# EAGLE design powerSwitch (EAGLE 9.6.2)
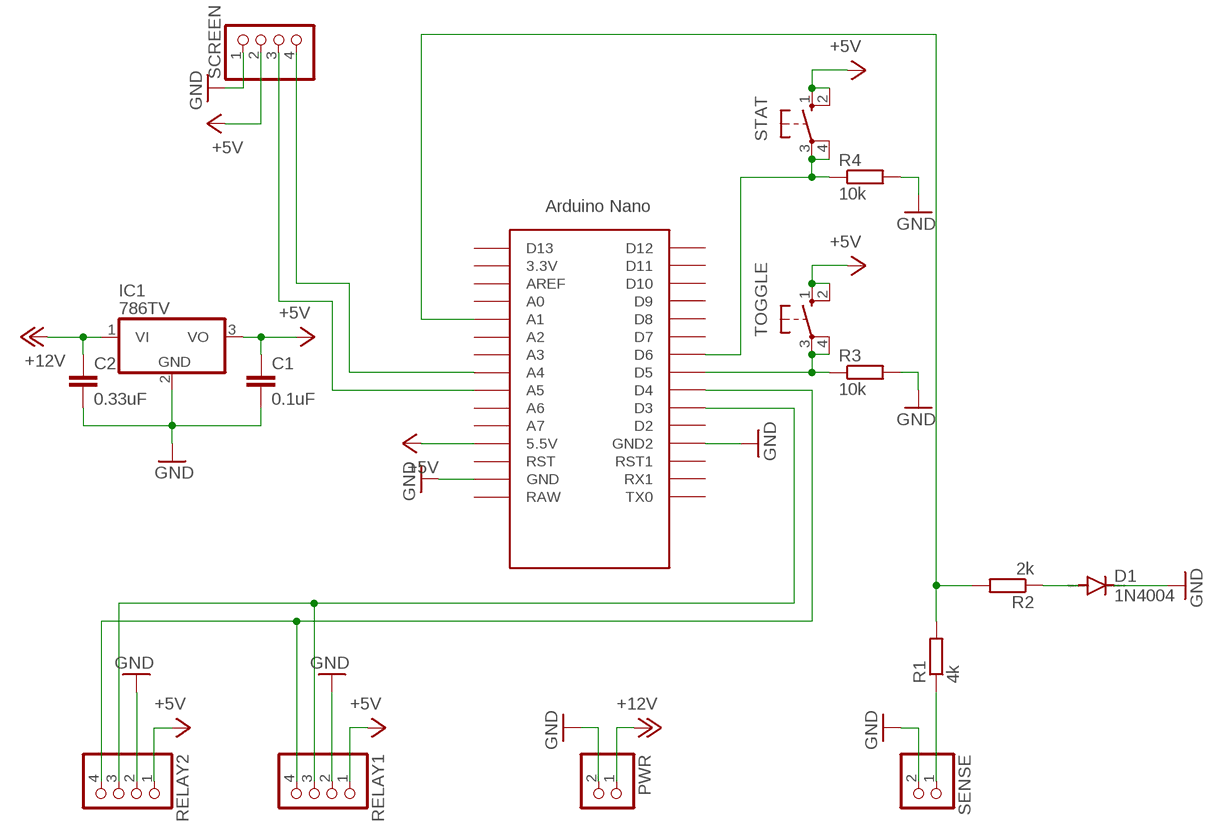
[diagram p0: schematic, sheet 1]

## Parts
C1  0.1uF  C5/2.5  [C5B2.5]
C2  0.33uF  C5/2.5  [C5B2.5]
D1  1N4004  [DO41-10]
IC1  786TV  [TO220V]
NANO  NANO  [NANO]
PWR  PINHD-1X2  [1X02]
R1  4k  R-EU_0204/7  [0204/7]
R2  2k  R-EU_0204/7  [0204/7]
R3  10k  R-EU_0204/7  [0204/7]
R4  10k  R-EU_0204/7  [0204/7]
RELAY1  PINHD-1X4  [1X04]
RELAY2  PINHD-1X4  [1X04]
SCREEN  PINHD-1X4  [1X04]
SENSE  PINHD-1X2  [1X02]
STAT  10-XX  [B3F-10XX]
TOGGLE  10-XX  [B3F-10XX]

## Nets
+5V: C1.1 IC1.3(VO) NANO.5V(5.5V) RELAY1.1 RELAY2.1 SCREEN.2 STAT.1(S) STAT.2(S1) TOGGLE.1(S) TOGGLE.2(S1)
+12V: C2.1 IC1.1(VI) PWR.1
GND: C1.2 C2.2 D1.C IC1.2(GND) NANO.GND NANO.GND1(GND2) PWR.2 R3.2 R4.2 RELAY1.2 RELAY2.2 SCREEN.1 SENSE.2
N$1: NANO.D3 RELAY1.3 RELAY2.3
N$2: NANO.D4 RELAY1.4 RELAY2.4
N$3: R1.1 SENSE.1
N$4: NANO.A1 R1.2 R2.2
N$5: D1.A R2.1
N$6: NANO.D5 R3.1 TOGGLE.3(P) TOGGLE.4(P1)
N$7: NANO.D6 R4.1 STAT.3(P) STAT.4(P1)
N$8: NANO.A5 SCREEN.3
N$9: NANO.A4 SCREEN.4
Unconnected: NANO.3.3V NANO.A0 NANO.A2 NANO.A3 NANO.A6 NANO.A7 NANO.AREF NANO.D2 NANO.D7 NANO.D8 NANO.D9 NANO.D10 NANO.D11 NANO.D12 NANO.D13 NANO.ICSP1 NANO.ICSP2 NANO.ICSP3 NANO.ICSP4 NANO.ICSP5 NANO.ICSP6 NANO.RAW NANO.RST NANO.RST1 NANO.RX1 NANO.TX0

## Library data of the parts
C1 C2 = capacitor-wima:C: CAPACITOR naming: grid - package width
D1 = diode:1N4004: DIODE general purpose rectifier, 1 A
IC1 = linear:78*: Positive VOLTAGE REGULATOR Source: http://cache.national.com/ds/LM/LM78L05.pdf http://www.fairchildsemi.com/ds/LM/LM7805.pdf
NANO = Arduino-clone:NANO: Arduino Nano
PWR SENSE = pinhead:PINHD-1X2: PIN HEADER
R1-R4 = rcl:R-EU_: RESISTOR, European symbol; SPICEPREFIX: R
RELAY1 RELAY2 SCREEN = pinhead:PINHD-1X4: PIN HEADER
STAT TOGGLE = switch-omron:10-XX: OMRON SWITCH; MPN: B3F-1000; OC_FARNELL: 176432; OC_NEWARK: 36M3542

## Board
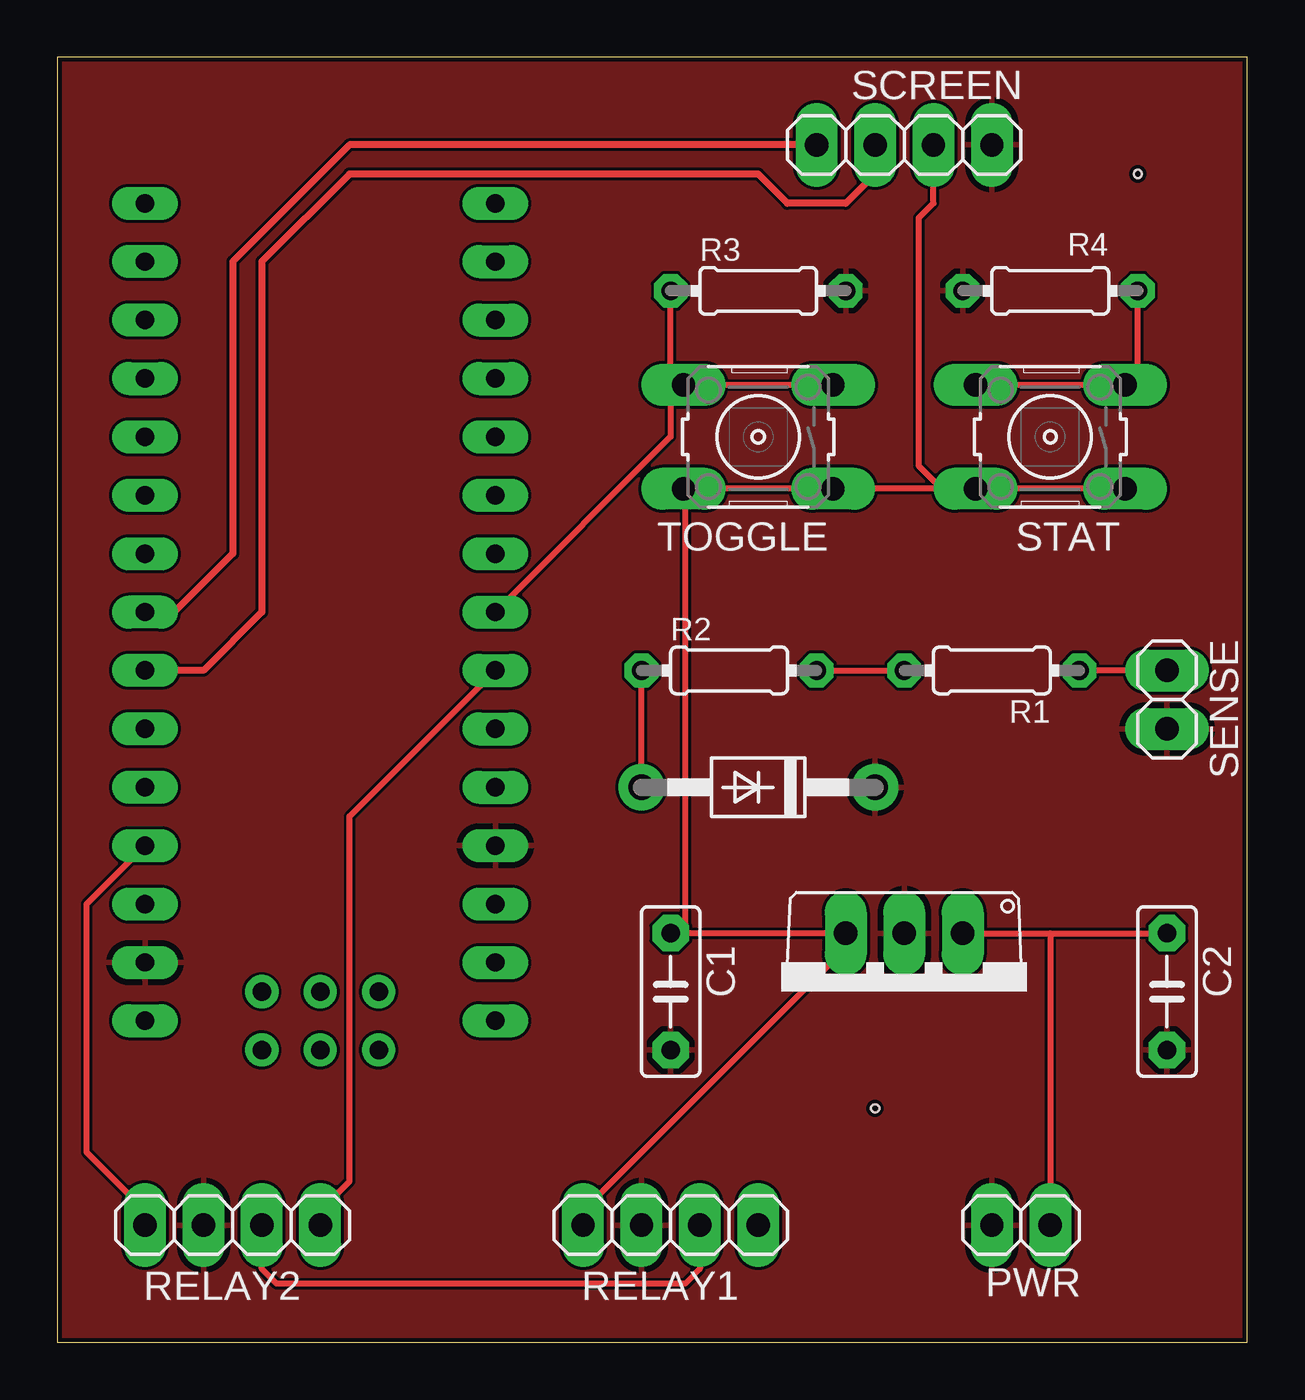
[diagram p1: board, top side]
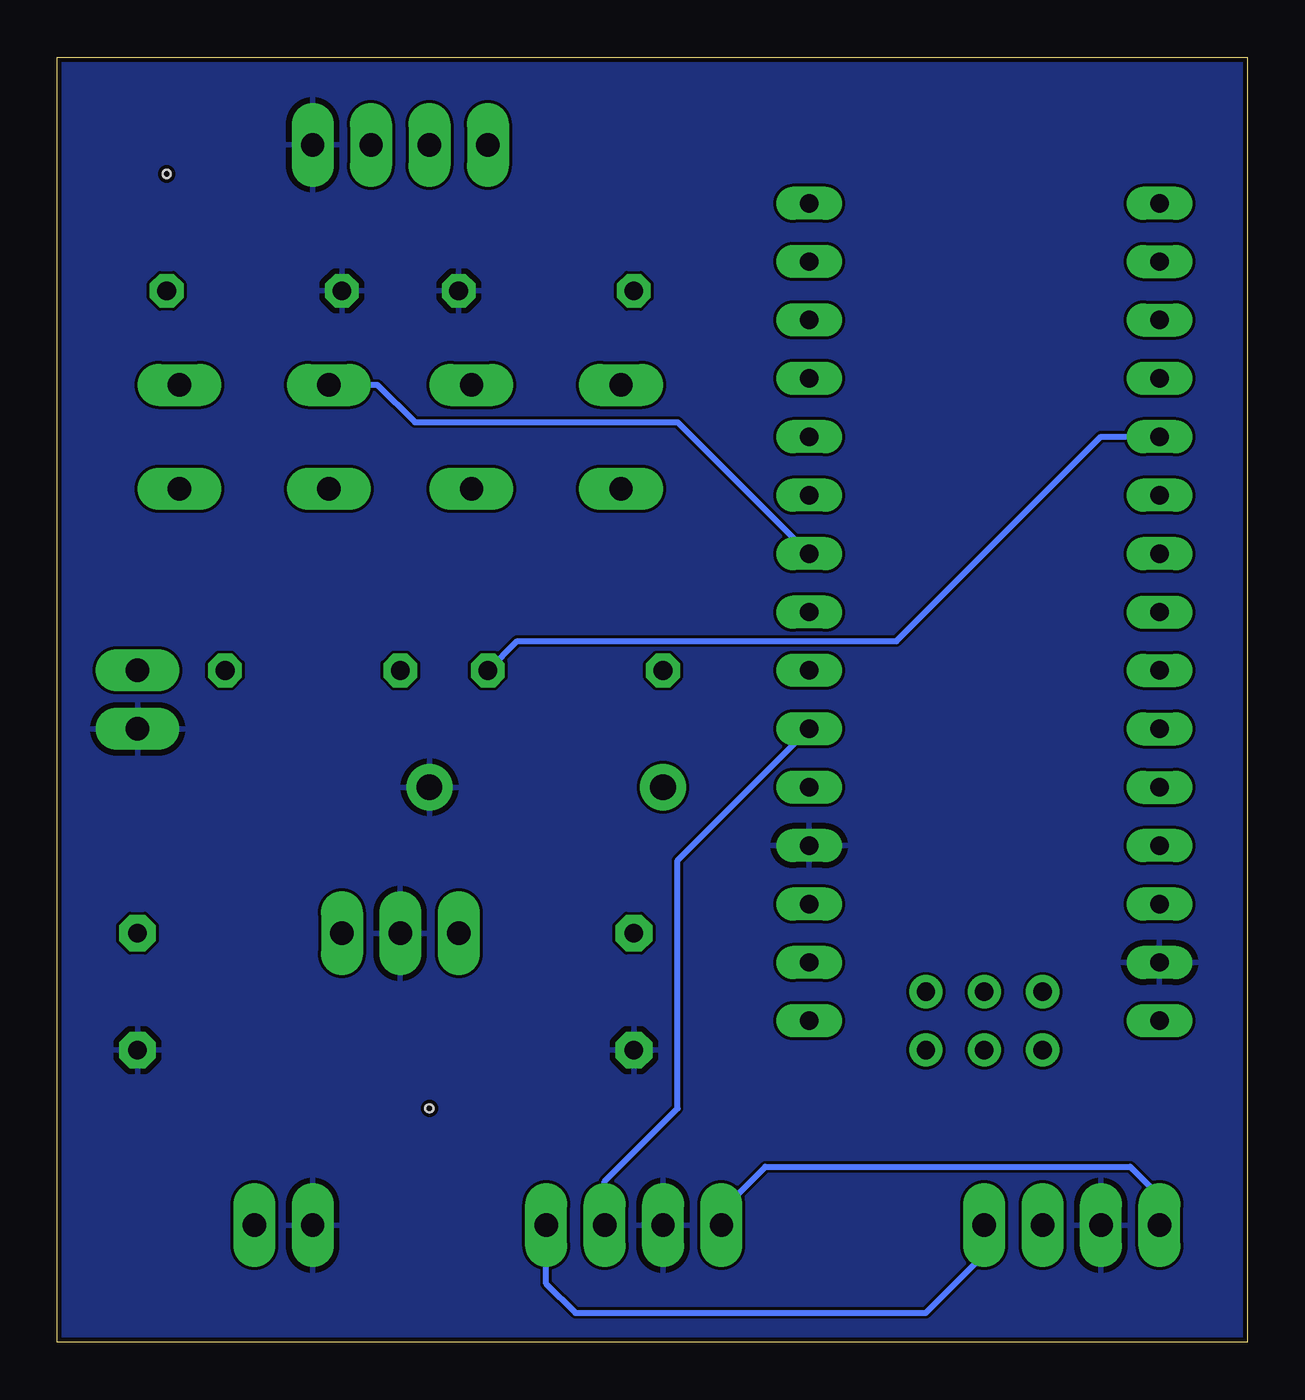
[diagram p2: board, bottom side, seen from below]

Size 51.74 x 55.87 mm. Coordinates in mm from the lower left corner, seen from the top.
Outline: 0,0 51.74,0 51.74,55.87 0,55.87 0,0
Copper layers (1*16): Top 0.035mm / dielectric 1.6mm / Bottom 0.035mm
Design rules "jlcpcb-2layers *": minimum track width 10mil, minimum drill 0.3mm, track to track 5mil, track to pad 5mil, pad to pad 5mil, via to via 5mil, smd to smd 5mil, copper to edge 0.2mm, drill to drill 6mil, minimum pad ring 10mil, minimum via ring 3mil, stop-mask expansion 4mil, vias tented up to drill 0mil, thermal gap 10mil
Holes 0.35 mm at 35.56,10.16 46.99,50.8

### Footprints (pad centres in the part's own frame; a part is rotated, then mirrored left to right if it is on the bottom)
C5B2.5 = drill 0.813 pad 1.6 octagon: 1 -2.54,0; 2 2.54,0
DO41-10 = drill 1.118: A 5.08,0; C -5.08,0
TO220V = drill 1.016 long: 1 -2.54,-2.54; 2 0,-2.54; 3 2.54,-2.54
NANO = drill 0.8 long: 3.3V -10.16,24.13; 5V -10.16,-1.27; A0 -10.16,19.05; A1 -10.16,16.51; A2 -10.16,13.97; A3 -10.16,11.43; A4 -10.16,8.89; A5 -10.16,6.35; A6 -10.16,3.81; A7 -10.16,1.27; AREF -10.16,21.59; D2 5.08,1.27; D3 5.08,3.81; D4 5.08,6.35; D5 5.08,8.89; D6 5.08,11.43; D7 5.08,13.97; D8 5.08,16.51; D9 5.08,19.05; D10 5.08,21.59; D11 5.08,24.13; D12 5.08,26.67; D13 -10.16,26.67; GND -10.16,-6.35; GND1 5.08,-1.27; RAW -10.16,-8.89; RST -10.16,-3.81; RST1 5.08,-3.81; RX1 5.08,-6.35; TX0 5.08,-8.89 | drill 0.8: ICSP1 -5.08,-10.16; ICSP2 -5.08,-7.62; ICSP3 -2.54,-10.16; ICSP4 -2.54,-7.62; ICSP5 0,-10.16; ICSP6 0,-7.62
1X02 = drill 1.016 long: 1 -1.27,0; 2 1.27,0
0204/7 = drill 0.813 octagon: 1 -3.81,0; 2 3.81,0
1X04 = drill 1.016 long: 1 -3.81,0; 2 -1.27,0; 3 1.27,0; 4 3.81,0
B3F-10XX = drill 1.016 long: 1 -3.251,2.261; 2 3.251,2.261; 3 -3.251,-2.261; 4 3.251,-2.261

### Placement (x,y rotation side)
C1  26.67,15.24 270 top
C2  48.26,15.24 270 top
D1  30.48,24.13 180 top
IC1  36.83,15.24 180 top
NANO  13.97,22.86 0 top
PWR  41.91,5.08 180 top
R1  40.64,29.21 180 top
R2  29.21,29.21 0 top
R3  30.48,45.72 0 top
R4  43.18,45.72 180 top
RELAY1  26.67,5.08 0 top
RELAY2  7.62,5.08 0 top
SCREEN  36.83,52.07 180 top
SENSE  48.26,27.94 270 top
STAT  43.18,39.37 180 top
TOGGLE  30.48,39.37 180 top

### Tracks (layer width: path | path; a pad name or v marks a point on that pad's centre or on a via)
+5V
  Top 0.254: STAT.2 38.46,37.11 37.47,38.1 37.47,48.9 38.1,49.53 SCREEN.2 | STAT.2 TOGGLE.1 TOGGLE.2 27.3,37.03 27.3,17.78 | 46.28,37.11 STAT.1 STAT.2 | NANO.5V 1.27,19.05 1.27,8.26 3.81,5.71 RELAY2.1 | 33.66,17.78 27.3,17.78 | RELAY1.1 22.86,5.71 33.66,16.51 33.66,17.78 | 33.66,17.78 IC1.3 | 27.3,17.78 C1.1
  Bottom 0.254: RELAY2.1 3.81,6.35 5.08,7.62 20.95,7.62 22.86,5.71 RELAY1.1
+12V
  Top 0.254: IC1.1 43.18,17.78 | 43.18,17.78 C2.1 | 43.18,17.78 PWR.1
GND
  pour Top: 0,55.88 52.07,55.88 52.07,0 0,0
  pour Bottom: 0,55.88 52.07,55.88 52.07,0 0,0
N$1
  Top 0.254: RELAY2.3 8.89,3.17 9.53,2.54 27.3,2.54 27.94,3.17 RELAY1.3
  Bottom 0.254: NANO.D3 24.77,20.95 24.77,10.16 27.94,6.99 RELAY1.3
N$2
  Top 0.254: NANO.D4 12.7,22.86 12.7,6.99 11.43,5.71 RELAY2.4
  Bottom 0.254: RELAY1.4 30.48,2.54 29.21,1.27 13.97,1.27 11.43,3.81 RELAY2.4
N$3
  Top 0.254: SENSE.1 R1.1
N$4
  Top 0.254: R2.2 R1.2
  Bottom 0.254: NANO.A1 6.35,39.37 15.24,30.48 31.75,30.48 R2.2
N$5
  Top 0.254: D1.A R2.1
N$6
  Top 0.254: NANO.D5 26.67,39.37 26.67,41.27 TOGGLE.4 | R3.1 26.67,41.91 TOGGLE.4 | TOGGLE.3 TOGGLE.4
N$7
  Top 0.254: R4.1 46.99,41.91 STAT.3 STAT.4
  Bottom 0.254: NANO.D6 24.77,40.01 36.2,40.01 37.82,41.63 STAT.4
N$8
  Top 0.305: SCREEN.3 35.56,50.8 34.29,49.53 31.75,49.53 30.48,50.8 12.7,50.8 8.89,46.99 8.89,31.75 6.35,29.21 NANO.A5
N$9
  Top 0.305: SCREEN.4 12.7,52.07 7.62,46.99 7.62,34.29 5.08,31.75 NANO.A4